# EAGLE design I2C-9555 (EAGLE 7.7.0)
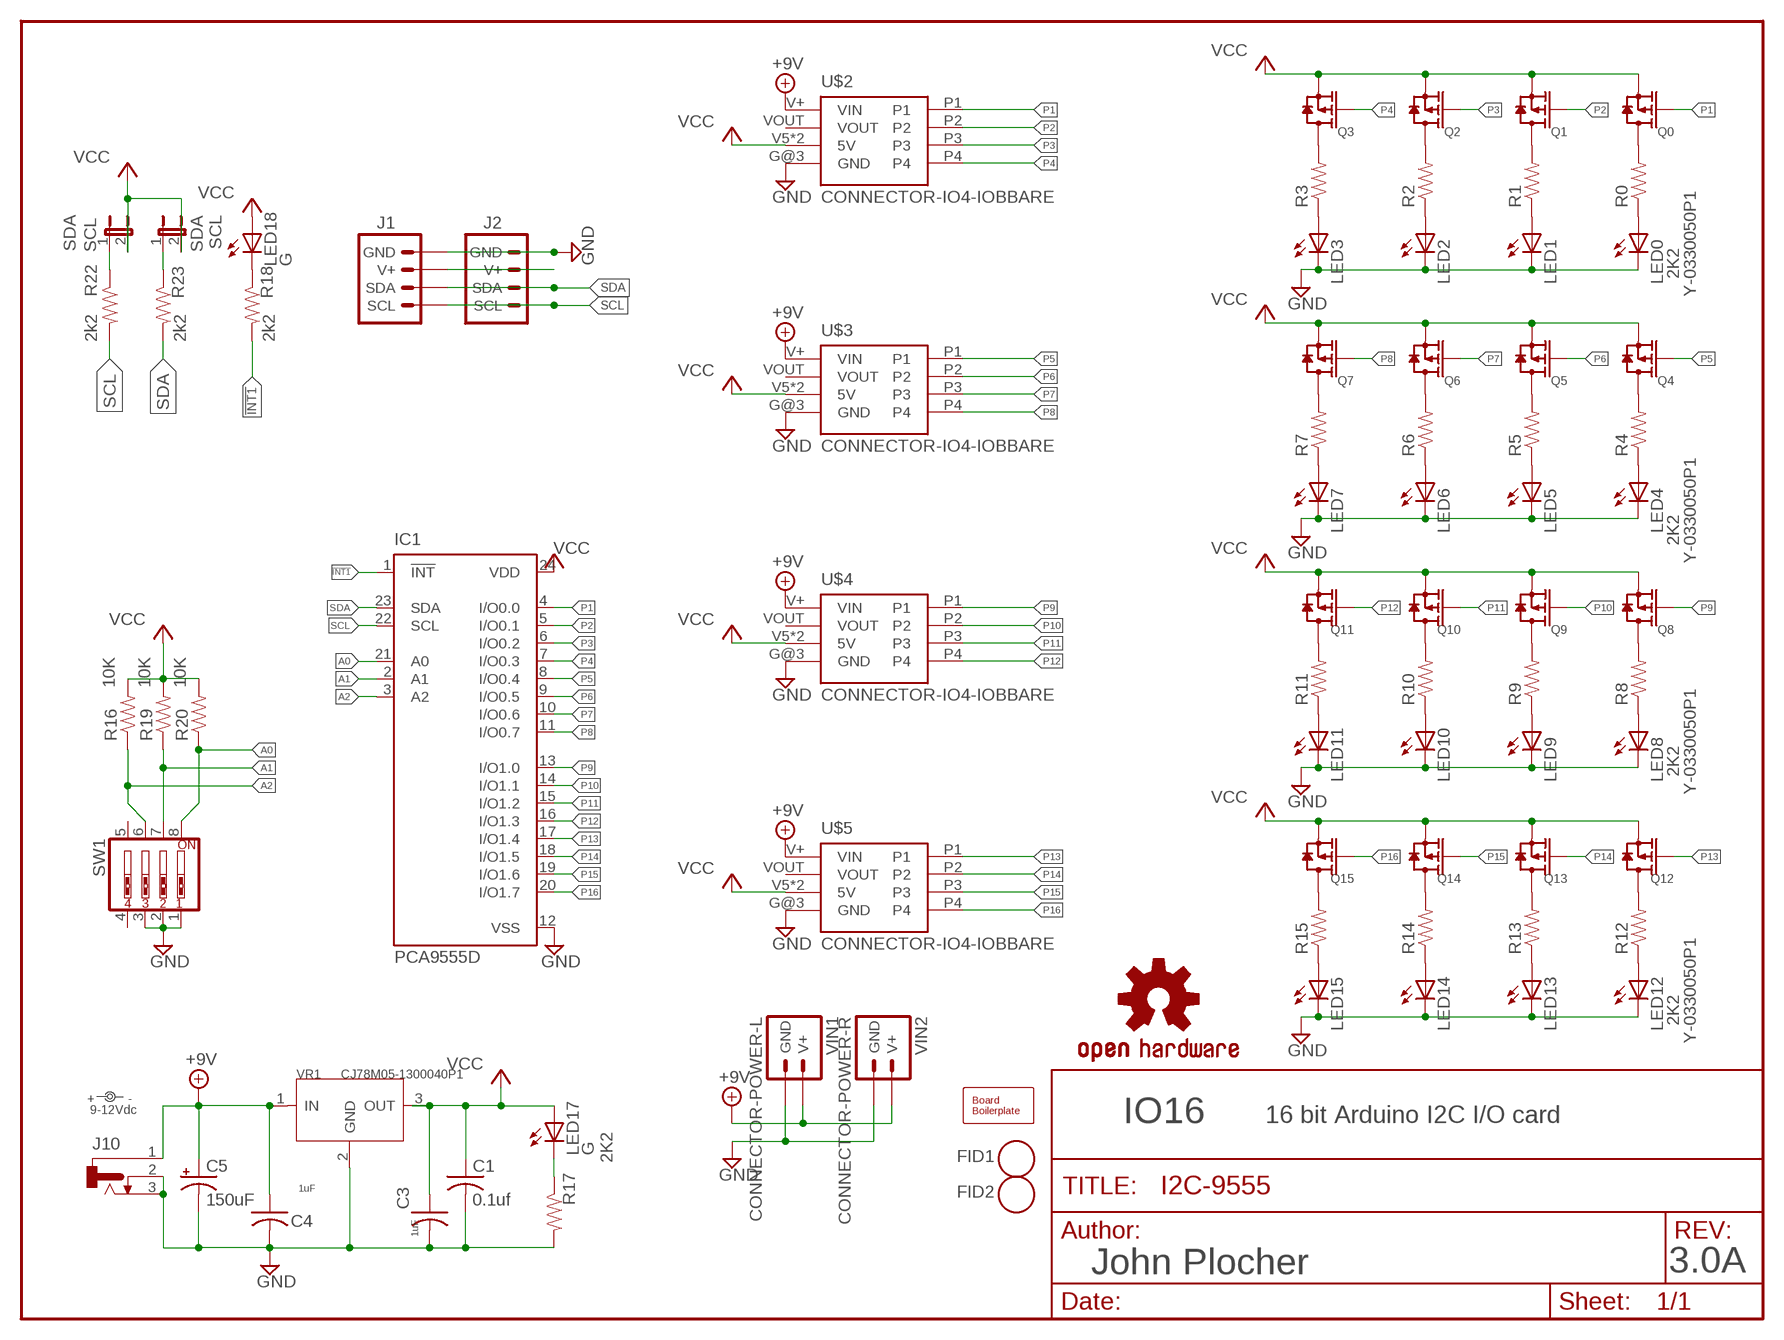
[diagram p0: schematic, sheet 1]

## Parts
BOARD1  BOARD80X100-IOB  [BOARD-DINRAIL-3.17IN-IOB]
C1  0.1uf  CAP0805  [0805-CAP]
C3  1uF  CAP0805  [0805-CAP]
C4  1uF  CAP0805  [0805-CAP]
C5  150uF  CAP-POL0810  [0810-CAP]
FID1  FIDUCIAL  [FIDUCIAL_1MM]
FID2  FIDUCIAL  [FIDUCIAL_1MM]
IC1  PCA9555D  [SO24]
J1  CONNECTOR-I2CLEFT  [I2C-L]
J2  CONNECTOR-I2CLEFT  [I2C-L]
J10  CONNECTOR-DC-POWER-RA  [DCJ0202]
LED0  Y-0330050P1  LED0603-LED  [0603-LED]
LED1  Y-0330050P1  LED0603-LED  [0603-LED]
LED2  Y-0330050P1  LED0603-LED  [0603-LED]
LED3  Y-0330050P1  LED0603-LED  [0603-LED]
LED4  Y-0330050P1  LED0603-LED  [0603-LED]
LED5  Y-0330050P1  LED0603-LED  [0603-LED]
LED6  Y-0330050P1  LED0603-LED  [0603-LED]
LED7  Y-0330050P1  LED0603-LED  [0603-LED]
LED8  Y-0330050P1  LED0603-LED  [0603-LED]
LED9  Y-0330050P1  LED0603-LED  [0603-LED]
LED10  Y-0330050P1  LED0603-LED  [0603-LED]
LED11  Y-0330050P1  LED0603-LED  [0603-LED]
LED12  Y-0330050P1  LED0603-LED  [0603-LED]
LED13  Y-0330050P1  LED0603-LED  [0603-LED]
LED14  Y-0330050P1  LED0603-LED  [0603-LED]
LED15  Y-0330050P1  LED0603-LED  [0603-LED]
LED17  G  LED0603-LED  [0603-LED]
LED18  G  LED0603-LED  [0603-LED]
POWER  9-12Vdc  DOC-POWER_LABEL  [PWR_LABEL]
Q0  MOSFET-P  [SOT23-3]
Q1  MOSFET-P  [SOT23-3]
Q2  MOSFET-P  [SOT23-3]
Q3  MOSFET-P  [SOT23-3]
Q4  MOSFET-P  [SOT23-3]
Q5  MOSFET-P  [SOT23-3]
Q6  MOSFET-P  [SOT23-3]
Q7  MOSFET-P  [SOT23-3]
Q8  MOSFET-P  [SOT23-3]
Q9  MOSFET-P  [SOT23-3]
Q10  MOSFET-P  [SOT23-3]
Q11  MOSFET-P  [SOT23-3]
Q12  MOSFET-P  [SOT23-3]
Q13  MOSFET-P  [SOT23-3]
Q14  MOSFET-P  [SOT23-3]
Q15  MOSFET-P  [SOT23-3]
R0  2K2  R0805-RES  [0805-RES]
R1  2K2  R0805-RES  [0805-RES]
R2  2K2  R0805-RES  [0805-RES]
R3  2K2  R0805-RES  [0805-RES]
R4  2K2  R0805-RES  [0805-RES]
R5  2K2  R0805-RES  [0805-RES]
R6  2K2  R0805-RES  [0805-RES]
R7  2K2  R0805-RES  [0805-RES]
R8  2K2  R0805-RES  [0805-RES]
R9  2K2  R0805-RES  [0805-RES]
R10  2K2  R0805-RES  [0805-RES]
R11  2K2  R0805-RES  [0805-RES]
R12  2K2  R0805-RES  [0805-RES]
R13  2K2  R0805-RES  [0805-RES]
R14  2K2  R0805-RES  [0805-RES]
R15  2K2  R0805-RES  [0805-RES]
R16  10K  R0805-RES  [0805-RES]
R17  2K2  R0805-RES  [0805-RES]
R18  2k2  R0805-RES  [0805-RES]
R19  10K  R0805-RES  [0805-RES]
R20  10K  R0805-RES  [0805-RES]
R22  2k2  R0805-RES  [0805-RES]
R23  2k2  R0805-RES  [0805-RES]
SCL  SDA  JUMPER-2PTH_LOCK  [1X02_LOCK]
SDA  SCL  JUMPER-2PTH_LOCK  [1X02_LOCK]
SW1  SW_DIP-4  [EDG-04]
U$1  OSHW-LOGOL  [OSHW-LOGO-L]
U$2  CONNECTOR-IO4-IOBBARE  [IO4-IOB]
U$3  CONNECTOR-IO4-IOBBARE  [IO4-IOB]
U$4  CONNECTOR-IO4-IOBBARE  [IO4-IOB]
U$5  CONNECTOR-IO4-IOBBARE  [IO4-IOB]
VIN1  CONNECTOR-POWER-L  [POWER-R2]
VIN2  CONNECTOR-POWER-R  [POWER-R]
VR1  CJ78M05-1300040P1  [TO252]

## Nets
!INT1 [signals]: IC1.1(!INT) R18.2
+9V [Power]: C4.1 C5.+ J10.1 U$2.V+(VIN) U$3.V+(VIN) U$4.V+(VIN) U$5.V+(VIN) VIN1.V+ VIN1.V+@1(V+) VIN1.V+@2(V+) VIN1.V+@3(V+) VIN2.V+ VIN2.V+@1(V+) VIN2.V+@2(V+) VIN2.V+@3(V+) VR1.1(IN)
A0 [signals]: IC1.21(A0) R20.1 SW1.8
A1 [signals]: IC1.2(A1) R19.1 SW1.7
A2 [signals]: IC1.3(A2) R16.1 SW1.6
GND [Power]: C1.2 C3.2 C4.2 C5.- IC1.12(VSS) J1.GND J1.GND@1(GND) J2.GND J2.GND@1(GND) J10.2 J10.3 LED0.C LED1.C LED2.C LED3.C LED4.C LED5.C LED6.C LED7.C LED8.C LED9.C LED10.C LED11.C LED12.C LED13.C LED14.C LED15.C R17.2 SW1.1 SW1.2 SW1.3 U$2.G@3(GND) U$3.G@3(GND) U$4.G@3(GND) U$5.G@3(GND) VIN1.GND VIN1.GND@1(GND) VIN1.GND@2(GND) VIN1.GND@3(GND) VIN2.GND VIN2.GND@1(GND) VIN2.GND@2(GND) VIN2.GND@3(GND) VR1.2(GND)
N$1: LED17.C R17.1
N$2: LED3.A R3.1
N$3: LED2.A R2.1
N$4: LED1.A R1.1
N$5: LED0.A R0.1
N$6: LED4.A R4.1
N$7: LED5.A R5.1
N$8: Q4.3(D) R4.2
N$9: LED6.A R6.1
N$10: LED7.A R7.1
N$11: Q0.3(D) R0.2
N$12: Q5.3(D) R5.2
N$13: Q6.3(D) R6.2
N$14: Q7.3(D) R7.2
N$15: LED11.A R11.1
N$16: LED10.A R10.1
N$17: LED9.A R9.1
N$18: Q8.3(D) R8.2
N$19 [signals]: R23.1 SCL.1
N$20 [signals]: R22.1 SDA.1
N$21: LED8.A R8.1
N$22: Q9.3(D) R9.2
N$23: Q10.3(D) R10.2
N$24: Q11.3(D) R11.2
N$25: LED15.A R15.1
N$26: LED14.A R14.1
N$27: LED13.A R13.1
N$28: LED12.A R12.1
N$30: Q1.3(D) R1.2
N$31: Q2.3(D) R2.2
N$32: Q3.3(D) R3.2
N$33: Q12.3(D) R12.2
N$34: Q13.3(D) R13.2
N$35: Q14.3(D) R14.2
N$36: Q15.3(D) R15.2
N$38: LED18.C R18.1
N$39: J1.V+ J1.V+@1(V+) J2.V+ J2.V+@1(V+)
P1 [signals]: IC1.4(I/O0.0) Q0.1(G) U$2.P1
P2 [signals]: IC1.5(I/O0.1) Q1.1(G) U$2.P2
P3 [signals]: IC1.6(I/O0.2) Q2.1(G) U$2.P3
P4 [signals]: IC1.7(I/O0.3) Q3.1(G) U$2.P4
P5 [signals]: IC1.8(I/O0.4) Q4.1(G) U$3.P1
P6 [signals]: IC1.9(I/O0.5) Q5.1(G) U$3.P2
P7 [signals]: IC1.10(I/O0.6) Q6.1(G) U$3.P3
P8 [signals]: IC1.11(I/O0.7) Q7.1(G) U$3.P4
P9 [signals]: IC1.13(I/O1.0) Q8.1(G) U$4.P1
P10 [signals]: IC1.14(I/O1.1) Q9.1(G) U$4.P2
P11 [signals]: IC1.15(I/O1.2) Q10.1(G) U$4.P3
P12 [signals]: IC1.16(I/O1.3) Q11.1(G) U$4.P4
P13 [signals]: IC1.17(I/O1.4) Q12.1(G) U$5.P1
P14 [signals]: IC1.18(I/O1.5) Q13.1(G) U$5.P2
P15 [signals]: IC1.19(I/O1.6) Q14.1(G) U$5.P3
P16 [signals]: IC1.20(I/O1.7) Q15.1(G) U$5.P4
SCL [signals]: IC1.22(SCL) J1.SCL J1.SCL@1(SCL) J2.SCL J2.SCL@1(SCL) R22.2
SDA [signals]: IC1.23(SDA) J1.SDA J1.SDA@1(SDA) J2.SDA J2.SDA@1(SDA) R23.2
VCC [Power]: C1.1 C3.1 IC1.24(VDD) LED17.A LED18.A Q0.2(S) Q1.2(S) Q2.2(S) Q3.2(S) Q4.2(S) Q5.2(S) Q6.2(S) Q7.2(S) Q8.2(S) Q9.2(S) Q10.2(S) Q11.2(S) Q12.2(S) Q13.2(S) Q14.2(S) Q15.2(S) R16.2 R19.2 R20.2 SCL.2 SDA.2 U$2.V5(5V) U$2.V5@1(5V) U$3.V5(5V) U$3.V5@1(5V) U$4.V5(5V) U$4.V5@1(5V) U$5.V5(5V) U$5.V5@1(5V) VR1.3(OUT)
Unconnected: SW1.4 SW1.5 U$2.VOUT U$3.VOUT U$4.VOUT U$5.VOUT

## Notes on the sheet
- IO16 | 16 bit Arduino I2C I/O card
- John Plocher | 3.0A

## Library data of the parts
BOARD1 = SPCoast:BOARD
C1 C3 C4 = SPCoast:CAP*
C5 = SPCoast:CAP-POL*
FID1 FID2 = SPCoast:FIDUCIAL: For use by pick and place machines to calibrate the vision/machine, 1mm By microbuilder.eu
IC1 = micro-philips:PCA9555: 16-bit I2C and SMBus I/O port with interrupt Source: PCA9555_5.pdf; MPN: PCA9555DW; OC_FARNELL: 1408295; OC_NEWARK: 63K6067
J1 J2 = SPCoast:CONNECTOR-I2C
J10 = SPCoast:CONNECTOR-DC-POWER: DC POWER JACK
LED0 LED1-LED15 LED17 LED18 = SPCoast:LED*
POWER = SPCoast:DOC-POWER_LABEL
Q0 Q1-Q15 = SPCoast:MOSFET-P: CJ2305：SMD MOSFET P-CH 8V-4.1A
R0 R1-R20 R22 R23 = SPCoast:R*: Resistor Basic schematic elements and footprints for 0603, 1206, and PTH 1/10th watt (small) resistors.
SCL SDA = SPCoast:JUMPER-2: Jumper Basic 0.1" spaced jumper. Use with breakaway headers.
SW1 = SPCoast:SW_DIP-4: DIP SWITCH
U$1 = SparkFun:OSHW-LOGO: Open Source Hardware Logo This logo indicates the piece of hardware it is found on incorporates a OSHW license and/or adheres to the definition of open source hardware found here: http://freedomdefined.org/OSHW
U$2-U$5 = SPCoast:CONNECTOR-IO4-IOB
VIN1 VIN2 = SPCoast:CONNECTOR-POWER
VR1 = OPL:CJ78M05: 0.5A Three Terminal Positive Voltage Regulators

## Net classes
0 default: width 0.254 mm, drill 0.6 mm
1 Power: width 0.406 mm, drill 0.6 mm
2 signals: width 0.254 mm, drill 0.6 mm

## Board
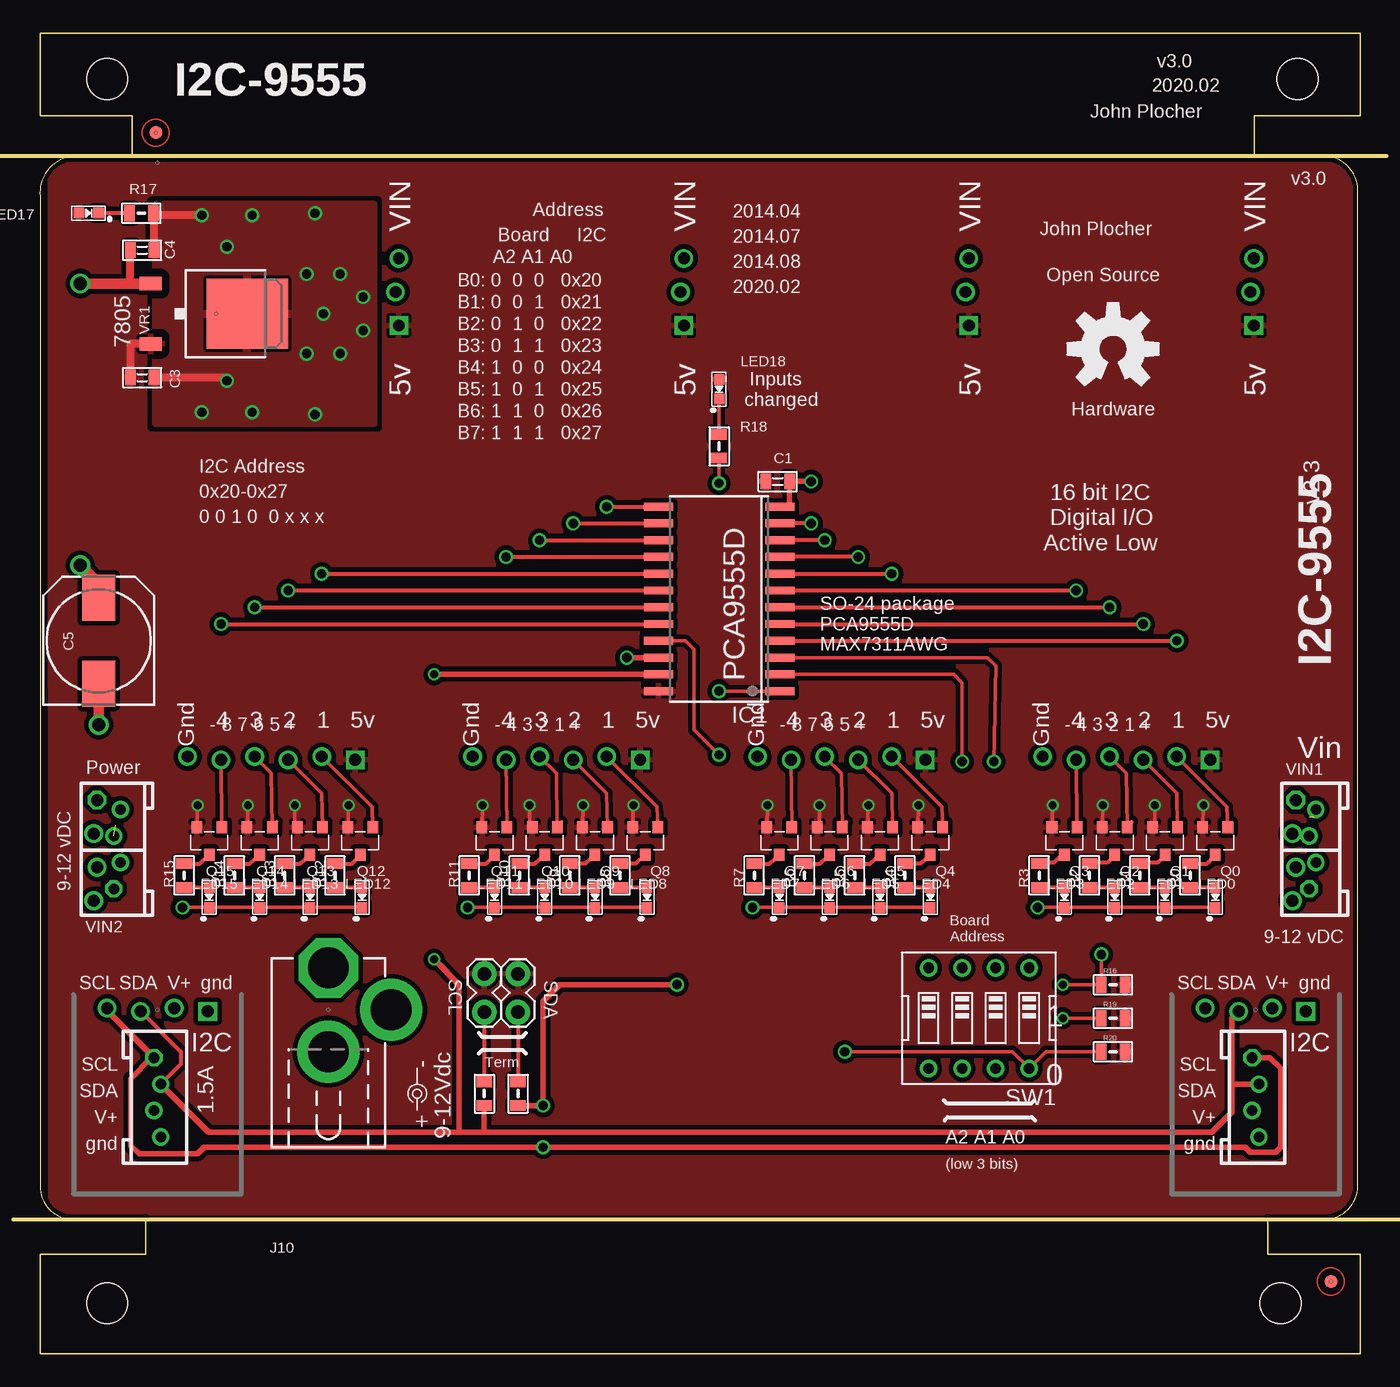
[diagram p1: board, top side]
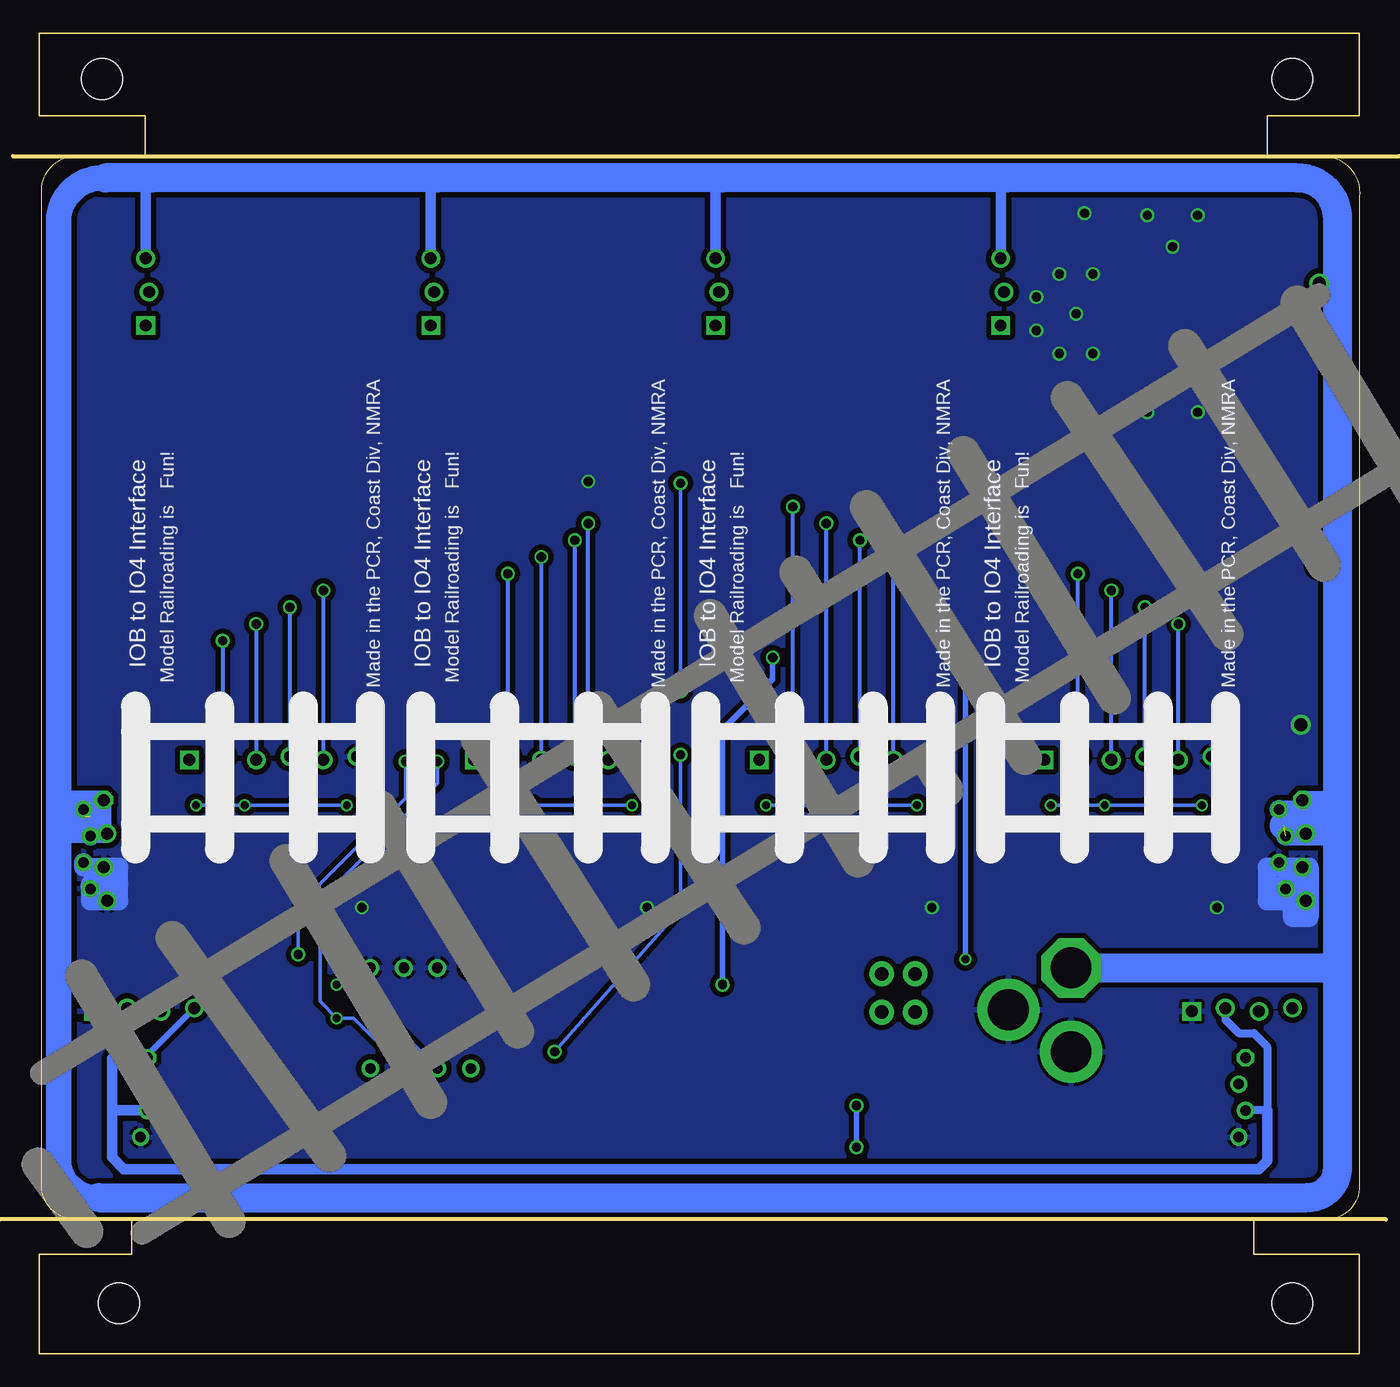
[diagram p2: board, bottom side, seen from below]

Size 100.01 x 100 mm. Coordinates in mm from the lower left corner, seen from the top.
Copper layers (1*16): Top 0.035mm / dielectric 1.5mm / Bottom 0.035mm
Design rules "Fusion_eagle_rule_v1.1": minimum track width 6mil, minimum drill 12mil, track to track 6mil, track to pad 6mil, pad to pad 6mil, via to via 6mil, smd to smd 0mil, copper to edge 10mil, drill to drill 10mil, minimum pad ring 10mil, minimum via ring 6mil, stop-mask expansion 2mil, vias tented up to drill 100mil, thermal gap 10mil

### Footprints (pad centres in the part's own frame; a part is rotated, then mirrored left to right if it is on the bottom)
BOARD-DINRAIL-3.17IN-IOB = hole 3.1: 5.08,96.52; 95.25,96.52; 5.08,3.81; 93.98,3.81
0805-CAP = smd 0.8 x 1.2: 1 -0.9,0; 2 0.9,0
0810-CAP = smd 3.5 x 2.5: + 3.25,0; - -3.25,0
FIDUCIAL_1MM = smd 1 x 1: 1 0,0
SO24 = smd 0.6 x 2.2: 1 -6.985,-4.6; 2 -5.715,-4.6; 3 -4.445,-4.6; 4 -3.175,-4.6; 5 -1.905,-4.6; 6 -0.635,-4.6; 7 0.635,-4.6; 8 1.905,-4.6; 9 3.175,-4.6; 10 4.445,-4.6; 11 5.715,-4.6; 12 6.985,-4.6; 13 6.985,4.6; 14 5.715,4.6; 15 4.445,4.6; 16 3.175,4.6; 17 1.905,4.6; 18 0.635,4.6; 19 -0.635,4.6; 20 -1.905,4.6; 21 -3.175,4.6; 22 -4.445,4.6; 23 -5.715,4.6; 24 -6.985,4.6
I2C-L = drill 0.9 square: GND 3.81,-0.127 | drill 0.8 pad 1.27: GND@1 0.254,-9.635; SDA@1 0.254,-5.635; V+@1 -0.254,-7.635 | drill 0.9: SCL -3.81,0.127; SDA -1.27,-0.127; V+ 1.27,0.127 | drill 0.8 pad 1.27 octagon: SCL@1 -0.254,-3.635
DCJ0202 = drill 3.1 pad 4.5 octagon: 1 0,3.175 | drill 3.1 pad 4.7: 2 4.763,0; 3 0,-3.175
0603-LED = smd 0.8 x 0.8: A -0.75,0; C 0.75,0
SOT23-3 = smd 0.8 x 0.9: 1 -0.95,-1; 2 0.95,-1; 3 0,1.1
0805-RES = smd 0.8 x 1.2: 1 -0.9,0; 2 0.9,0
1X02_LOCK = drill 1.016 pad 1.88: 1 -0.178,0; 2 2.718,0
EDG-04 = drill 0.813: 1 -3.81,-3.81; 2 -1.27,-3.81; 3 1.27,-3.81; 4 3.81,-3.81; 5 3.81,3.81; 6 1.27,3.81; 7 -1.27,3.81; 8 -3.81,3.81
IO4-IOB = drill 0.9: G@3 44.958,2.286; P1 44.958,12.446; P2 45.212,9.906; P3 44.958,7.366; P4 45.212,4.826; V+ 7.239,18.288; VOUT 9.779,18.034 | drill 0.9 square: V5 12.319,18.288; V5@1 45.212,14.986
POWER-R2 = drill 0.9: GND -0.762,-1.27; GND@1 -1.016,-3.81; V+ -1.016,1.27 | drill 0.8 pad 1.27: GND@2 0.762,-0.904; V+@2 0.762,3.096; V+@3 0.254,1.096 | drill 0.8 pad 1.27 octagon: GND@3 0.254,-2.904 | drill 0.9 octagon: V+@1 -0.762,3.81
POWER-R = drill 0.9: GND -2.032,-1.27; GND@1 -2.286,-3.81; V+ -2.286,1.27 | drill 0.8 pad 1.27: GND@2 -0.254,-0.904; V+@2 -0.254,3.096; V+@3 -0.762,1.096 | drill 0.8 pad 1.27 octagon: GND@3 -0.762,-2.904 | drill 0.9 octagon: V+@1 -2.032,3.81
TO252 = smd 1.016 x 1.651: 1 -2.286,-4.826; 3 2.286,-4.826 | smd 5.3 x 6.2: 2 0,2.5

### Placement (x,y rotation side)
BOARD1  0.01,0 0 top
C1  55.89,66.04 0 top
C3  7.76,73.91 0 top
C4  7.76,83.57 0 top
C5  4.46,53.98 90 top
FID1  97.8,5.46 0 top
FID2  8.78,92.46 0 top
IC1  51.45,57.15 90 top
J1  92.09,26.04 0 top
J2  8.9,26.04 0 top
J10  21.86,26.04 0 top
LED0  89.04,34.54 270 top
LED1  85.23,34.54 270 top
LED2  81.42,34.54 270 top
LED3  77.61,34.54 270 top
LED4  67.45,34.54 270 top
LED5  63.64,34.54 270 top
LED6  59.83,34.54 270 top
LED7  56.02,34.54 270 top
LED8  45.99,34.54 270 top
LED9  42.05,34.54 270 top
LED10  38.24,34.54 270 top
LED11  34.43,34.54 270 top
LED12  24.4,34.54 270 top
LED13  20.46,34.54 270 top
LED14  16.65,34.54 270 top
LED15  12.84,34.54 270 top
LED17  3.7,86.36 0 top
LED18  51.45,73.03 270 top
POWER  28.59,19.68 180 top
Q0  89.04,38.86 180 top
Q1  85.23,38.86 180 top
Q2  81.42,38.86 180 top
Q3  77.61,38.86 180 top
Q4  67.45,38.86 180 top
Q5  63.64,38.86 180 top
Q6  59.83,38.86 180 top
Q7  56.02,38.86 180 top
Q8  45.86,38.86 180 top
Q9  42.05,38.86 180 top
Q10  38.24,38.86 180 top
Q11  34.43,38.86 180 top
Q12  24.27,38.86 180 top
Q13  20.46,38.86 180 top
Q14  16.65,38.86 180 top
Q15  12.84,38.86 180 top
R0  87.14,36.2 90 top
R1  83.33,36.2 90 top
R2  79.52,36.2 90 top
R3  75.71,36.2 90 top
R4  65.55,36.2 90 top
R5  61.74,36.2 90 top
R6  57.93,36.2 90 top
R7  54.12,36.2 90 top
R8  43.96,36.2 90 top
R9  40.15,36.2 90 top
R10  36.34,36.2 90 top
R11  32.53,36.2 90 top
R12  22.37,36.2 90 top
R13  18.56,36.2 90 top
R14  14.75,36.2 90 top
R15  10.94,36.2 90 top
R16  81.29,27.94 0 top
R17  7.7,86.36 0 top
R18  51.45,68.71 270 top
R19  81.29,25.4 0 top
R20  81.29,22.86 0 top
R22  36.21,19.68 270 top
R23  33.67,19.68 270 top
SCL  33.67,26.04 90 top
SDA  36.21,26.04 90 top
SW1  71.13,25.4 180 top
U$1  81.29,76.07 0 top
U$2  73.67,90.17 270 top
U$3  52.08,90.17 270 top
U$4  30.49,90.17 270 top
U$5  8.9,90.17 270 top
VIN1  95.9,38.1 0 top
VIN2  6.36,38.1 0 top
VR1  13.22,78.74 270 top

### Tracks (layer width: path | path; a pad name or v marks a point on that pad's centre or on a via)
!INT1  (via drill 0.7)
  Top 0.254: R18.2 v51.45,65.91 | v51.45,50.16 IC1.1
  Bottom 0.254: v51.45,65.91 v51.45,50.16
+9V  (via drill 1)  (2 unrouted)
  Top 0.61: 8.38,81.02 VR1.1 6.86,81.03 C4.1
  Top 0.813: C5.+ 4.41,58.42 v3.06,59.69 | v3.06,81.03 VR1.1
  Bottom 0.813: U$2.V+ 91.96,88.52 91.45,89.03 | U$3.V+ 70.37,88.52 69.86,89.03 | U$4.V+ 48.78,88.52 48.27,89.03 | U$5.V+ 27.19,88.52 26.68,89.03 | v3.06,59.69 1.66,59.69 | 1.66,83.52 1.71,81.03 v3.06,81.03
  Bottom 1.422: VIN2.V+@1 2.55,41.91 2.55,41.2 | 2.55,39.37 VIN2.V+ | VIN2.V+@2 2.55,41.2 | 2.55,41.2 2.55,39.37 | VIN2.V+@3 2.55,39.2 2.55,39.37 | VIN1.V+@2 97.8,41.2 97.8,41.91 VIN1.V+@1 95.26,41.91 95.26,40.64 | VIN1.V+ 97.8,39.37 97.8,40.01 95.26,40.01 95.26,40.64 | 95.26,40.64 96.53,40.64 | VIN1.V+@3 96.15,40.64 98.57,40.64
  Bottom 1.93: 95.01,89.03 arc-90 98.57,85.85 98.57,40.64 98.57,14.48 arc-90 95.52,11.81
  Bottom 2.184: 5.73,40.01 1.66,40.01 | 1.66,40.01 1.66,59.69 1.66,83.52 1.66,85.98 arc-90 4.71,89.03 26.68,89.03 48.27,89.03 69.86,89.03 91.45,89.03 95.01,89.03 | 95.52,11.81 3.95,11.81 arc-90 1.66,14.1 1.66,29.21 | 1.66,29.21 1.66,40.01 | J10.1 1.66,29.21
A0  (via drill 0.7)
  Top 0.254: v60.97,22.86 73.67,22.86 SW1.8 76.21,22.86 R20.1 | IC1.21 48.91,53.98 49.54,53.34 49.54,47.24 v51.45,45.34
  Bottom 0.254: v51.45,45.34 51.45,33.66 v60.97,22.86
A1  (via drill 0.6, 0.7)
  Top 0.254: R19.1 v77.48,25.4 | IC1.2 69.23,51.44 69.86,50.8 v69.86,44.83
  Bottom 0.254: SW1.7 76.21,25.4 v77.48,25.4 78.75,26.67 78.75,34.29 69.86,43.18 v69.86,44.83
A2  (via drill 0.6, 0.7)
  Top 0.254: v77.48,27.94 R16.1 80.4,27.95 v80.4,30.23 | IC1.3 71.77,52.7 72.4,52.07 v72.28,44.83
  Bottom 0.254: v77.48,27.94 76.21,27.94 SW1.6 | v80.4,30.23 80.4,33.91 72.28,42.04 v72.28,44.83
GND  (via drill 0.7, 1)
  Top 0.254: LED12.C LED13.C LED14.C LED15.C 10.82,33.79 v10.81,33.78 | LED8.C LED9.C LED10.C LED11.C 32.41,33.79 v32.4,33.78 | LED4.C LED5.C LED6.C LED7.C 54,33.79 v53.99,33.78 | LED0.C LED1.C LED2.C LED3.C 75.59,33.79 v75.58,33.78
  Top 0.406: IC1.12 56.79,64.14 C1.2 v58.43,66.04
  Top 0.61: v12.27,86.2 8.76,86.2 R17.2 8.66,86.3 C4.2 | C3.2 13.92,73.91 v14.17,73.66
  Top 0.813: v4.46,47.62 C5.-
  Bottom 1.422: 5.73,35.56 3.82,35.56 3.82,34.29 7,34.29 7,36.83 VIN2.GND 3.82,36.83 3.82,33.02 5.09,33.02 5.09,33.66 | VIN1.GND@2 96.66,36.83 VIN1.GND 93.99,36.83 93.99,35.56 | 93.99,35.56 93.99,34.29 96.15,34.29 VIN1.GND@3 96.15,35.56 93.99,35.56
  other vias: 20.84,86.36 16.08,86.2 14.17,83.82 22.75,75.72 24.49,80.01 24.49,77.47 20.21,75.72 20.21,81.76 21.48,78.74 22.75,81.76 20.84,71.12 12.27,71.28 16.08,71.28
  pour Bottom (isolate 0.406, rank 2): 100.28,10.64 100.25,90.68 0.79,90.68 0.82,10.52
  pour Top (isolate 0.61): 8.78,70.48 25.29,70.48 25.29,87 8.78,87
N$1
  Top 0.305: R17.1 LED17.C
N$2
  Top 0.305: R3.1 LED3.A
N$3
  Top 0.305: R2.1 LED2.A
N$4
  Top 0.305: R1.1 LED1.A
N$5
  Top 0.305: R0.1 LED0.A
N$6
  Top 0.305: R4.1 LED4.A
N$7
  Top 0.305: R5.1 LED5.A
N$8
  Top 0.305: Q4.3 66.7,37.09 R4.2
N$9
  Top 0.305: R6.1 LED6.A
N$10
  Top 0.305: R7.1 LED7.A
N$11
  Top 0.305: R0.2 88.42,37.09 88.53,37.21 Q0.3
N$12
  Top 0.305: R5.2 62.89,37.09 Q5.3
N$13
  Top 0.305: R6.2 59.08,37.09 Q6.3
N$14
  Top 0.305: R7.2 55.27,37.09 Q7.3
N$15
  Top 0.305: R11.1 LED11.A
N$16
  Top 0.305: R10.1 LED10.A
N$17
  Top 0.305: R9.1 LED9.A
N$18
  Top 0.305: Q8.3 45.11,37.09 R8.2
N$19
  Top 0.305: SCL.1 R23.1
N$20
  Top 0.305: SDA.1 R22.1
N$21
  Top 0.305: R8.1 LED8.A
N$22
  Top 0.305: Q9.3 41.3,37.09 R9.2
N$23
  Top 0.305: R10.2 37.49,37.09 Q10.3
N$24
  Top 0.305: R11.2 33.81,37.09 33.92,37.21 Q11.3
N$25
  Top 0.305: R15.1 LED15.A
N$26
  Top 0.305: R14.1 LED14.A
N$27
  Top 0.305: R13.1 LED13.A
N$28
  Top 0.305: R12.1 LED12.A
N$30
  Top 0.305: R1.2 83.58,37.08 83.71,37.21 84.72,37.21 85.23,37.72 Q1.3
N$31
  Top 0.305: R2.2 79.64,37.21 80.91,37.21 81.42,37.72 Q2.3
N$32
  Top 0.305: R3.2 75.96,37.21 76.85,37.21 77.48,37.85 Q3.3
N$33
  Top 0.305: R12.2 23.65,37.09 23.76,37.21 Q12.3
N$34
  Top 0.305: R13.2 19.71,37.09 Q13.3
N$35
  Top 0.305: R14.2 15.9,37.09 Q14.3
N$36
  Top 0.305: R15.2 12.09,37.09 Q15.3
N$38
  Top 0.254: LED18.C R18.1
N$39
  Bottom 0.61: J2.V+@1 8.66,18.41 7,18.43 7,23.24 8.01,24.26 9.16,24.26 10.17,25.27 J2.V+
  Bottom 0.813: 7,18.43 7,14.61 7.63,13.97 93.61,13.97 94.5,14.86 94.5,18.41 | J1.V+ 93.36,23.5 94.5,22.35 94.5,18.41 | 94.5,18.41 91.85,18.41 J1.V+@1
P1  (via drill 0.7)
  Top 0.254: U$2.P1 89.93,41.4 Q0.1
  Top 0.305: IC1.4 v86.12,53.98
  Bottom 0.305: v86.12,53.98 U$2.P1
P2  (via drill 0.7)
  Top 0.254: U$2.P2 86.12,42.42 Q1.1
  Top 0.305: IC1.5 v83.58,55.24
  Bottom 0.305: v83.58,55.24 U$2.P2
P3  (via drill 0.7)
  Top 0.254: U$2.P3 82.31,43.94 Q2.1
  Top 0.305: 82.69,40.26 Q2.1 | IC1.6 v81.04,56.52
  Bottom 0.305: v81.04,56.52 U$2.P3
P4  (via drill 0.7)
  Top 0.254: U$2.P4 Q3.1
  Top 0.305: IC1.7 v78.5,57.78
  Bottom 0.305: v78.5,57.78 U$2.P4
P5  (via drill 0.7)
  Top 0.254: U$3.P1 68.34,41.4 Q4.1
  Top 0.305: IC1.8 v64.53,59.05
  Bottom 0.305: v64.53,59.05 U$3.P1
P6  (via drill 0.7)
  Top 0.254: U$3.P2 64.53,42.42 Q5.1
  Top 0.305: v61.99,60.33 IC1.9
  Bottom 0.305: U$3.P2 v61.99,60.33
P7  (via drill 0.7)
  Top 0.254: U$3.P3 60.72,43.94 Q6.1
  Top 0.305: Q6.1 61.1,40.26 | v59.45,61.59 IC1.10
  Bottom 0.305: U$3.P3 v59.45,61.59
P8  (via drill 0.7)
  Top 0.254: Q7.1 U$3.P4
  Top 0.305: v58.43,62.87 IC1.11
  Bottom 0.305: U$3.P4 56.91,46.74 58.43,48.26 v58.43,62.87
P9  (via drill 0.7)
  Top 0.254: U$4.P1 46.75,41.4 Q8.1
  Top 0.305: v42.94,64.14 IC1.13
  Bottom 0.305: U$4.P1 v42.94,64.14
P10  (via drill 0.7)
  Top 0.254: U$4.P2 42.94,42.42 Q9.1
  Top 0.305: v40.4,62.87 IC1.14
  Bottom 0.305: U$4.P2 v40.4,62.87
P11  (via drill 0.7)
  Top 0.254: 39.51,40.26 Q10.1 39.13,43.94 U$4.P3
  Top 0.305: v37.86,61.59 IC1.15
  Bottom 0.305: U$4.P3 v37.86,61.59
P12  (via drill 0.7)
  Top 0.254: U$4.P4 Q11.1
  Top 0.305: v35.32,60.33 IC1.16
  Bottom 0.305: U$4.P4 v35.32,60.33
P13  (via drill 0.7)
  Top 0.254: U$5.P1 25.16,41.4 Q12.1
  Top 0.305: v21.35,59.05 IC1.17
  Bottom 0.305: U$5.P1 v21.35,59.05
P14  (via drill 0.7)
  Top 0.254: U$5.P2 21.35,42.42 Q13.1
  Top 0.305: v18.81,57.78 IC1.18
  Bottom 0.305: U$5.P2 v18.81,57.78
P15  (via drill 0.7)
  Top 0.254: 17.92,40.26 Q14.1 17.54,43.94 U$5.P3
  Top 0.305: v16.27,56.52 IC1.19
  Bottom 0.305: U$5.P3 v16.27,56.52
P16  (via drill 0.7)
  Top 0.254: Q15.1 U$5.P4
  Top 0.305: v13.73,55.24 IC1.20
  Bottom 0.305: U$5.P4 v13.73,55.24
SCL  (via drill 0.7)
  Top 0.305: J2.SCL 5.09,25.96
  Top 0.406: 5.09,25.96 J2.SCL@1 8.44,22.4 6.87,20.83 6.87,15.75 7.51,15.11 11.95,15.11 12.46,15.62 v38.11,15.62 91.33,15.62 91.71,15.24 93.61,15.24 93.99,15.62 93.99,21.59 93.18,22.4 J1.SCL@1 | R22.2 v38.11,18.79 38.11,26.67 39.38,27.94 v48.27,27.94 | IC1.22 v44.46,52.7
  Bottom 0.406: v38.11,18.79 v38.11,15.62 | v44.46,52.7 44.46,51.05 48.27,47.24 v48.27,27.94 | J1.SCL 91.83,22.61 J1.SCL@1
SDA  (via drill 0.6)
  Top 0.305: J2.SDA 10.68,22.86 10.68,21.92 J2.SDA@1
  Top 0.406: J2.SDA@1 12.79,16.76 31.76,16.76 | 31.76,16.76 33.67,16.76 | 33.67,16.76 R23.2 | 33.67,16.76 88.79,16.76 90.31,18.29 90.31,20.4 | IC1.23 v29.86,51.44 | v29.86,29.84 31.76,27.94 31.76,16.76 | J1.SDA 90.31,25.4 90.31,20.4 | 90.31,20.4 J1.SDA@1
  Bottom 0.406: v29.86,51.44 v29.86,29.84
VCC  (via drill 0.6)
  Top 0.254: Q15.2 v11.95,41.53 | v23.38,41.53 Q12.2 | Q13.2 19.32,40.13 v19.32,41.53 | Q14.2 v15.76,41.53 | Q11.2 v33.54,41.53 | v44.97,41.53 Q8.2 | Q9.2 v41.16,41.53 | Q10.2 37.1,39.88 v37.1,41.53 | Q7.2 v55.13,41.53 | v66.56,41.53 Q4.2 | Q5.2 v62.75,41.53 | Q6.2 59.07,39.88 v59.07,41.53 | Q3.2 v76.72,41.53 | v88.15,41.53 Q0.2 | Q2.2 v80.53,41.53 | Q1.2 84.47,39.88 v84.47,41.53
  Top 0.61: VR1.3 8.38,76.47 6.86,76.47 C3.1
  Bottom 0.254: v11.95,41.53 v15.76,41.53 v19.32,41.53 v23.38,41.53 | v33.54,41.53 v37.1,41.53 v41.16,41.53 v44.97,41.53 | v55.13,41.53 v59.07,41.53 v62.75,41.53 v66.56,41.53 | v76.72,41.53 v80.53,41.53 v84.47,41.53 v88.15,41.53
  pour Top (isolate 0.356, rank 2): 100.28,10.67 100.25,90.04 0.79,90.04 0.82,10.67

### Text on the board
tPlace: v3.0 | 2020.02 | John Plocher | v3.0 | Address | 2014.04 | John Plocher | Board I2C | 2014.07 | A2 A1 A0 | 2014.08 | B0: 0 0 0 0x20 | Open Source | 2020.02 | B1: 0 0 1 0x21 | B2: 0 1 0 0x22 | 7805 | B3: 0 1 1 0x23 | B4: 1 0 0 0x24 | B5: 1 0 1 0x25 | Inputs / changed | B6: 1 1 0 0x26 | Hardware | B7: 1 1 1 0x27 | I2C Address | 0x20-0x27 | v2.3 | 0 0 1 0 0 x x x | 16 bit I2C / Digital I/O / Active Low | SO-24 package / PCA9555D / MAX7311AWG | - 8 7 6 5 + | - 4 3 2 1 + | - 8 7 6 5 + | - 4 3 2 1 + | Power | Vin | 9-12 vDC | 9-12 vDC | Board / Address | 1 | Term | 0 | 1.5A | A2 A1 A0 | (low 3 bits)
tDocu: Vin
bDocu: Made in the PCR, Coast Division, NMRA | IO16-9555 | Model Railroading is fun! | 16 bit (4x IO4 ports) / I2C digital I/O | Go Bears! | www. SP Coast .com | Active Low: | A "1" bit in the I/O register is associated with a LOW voltage on a pin